# EAGLE design or-clock_main (EAGLE 6.5.0)
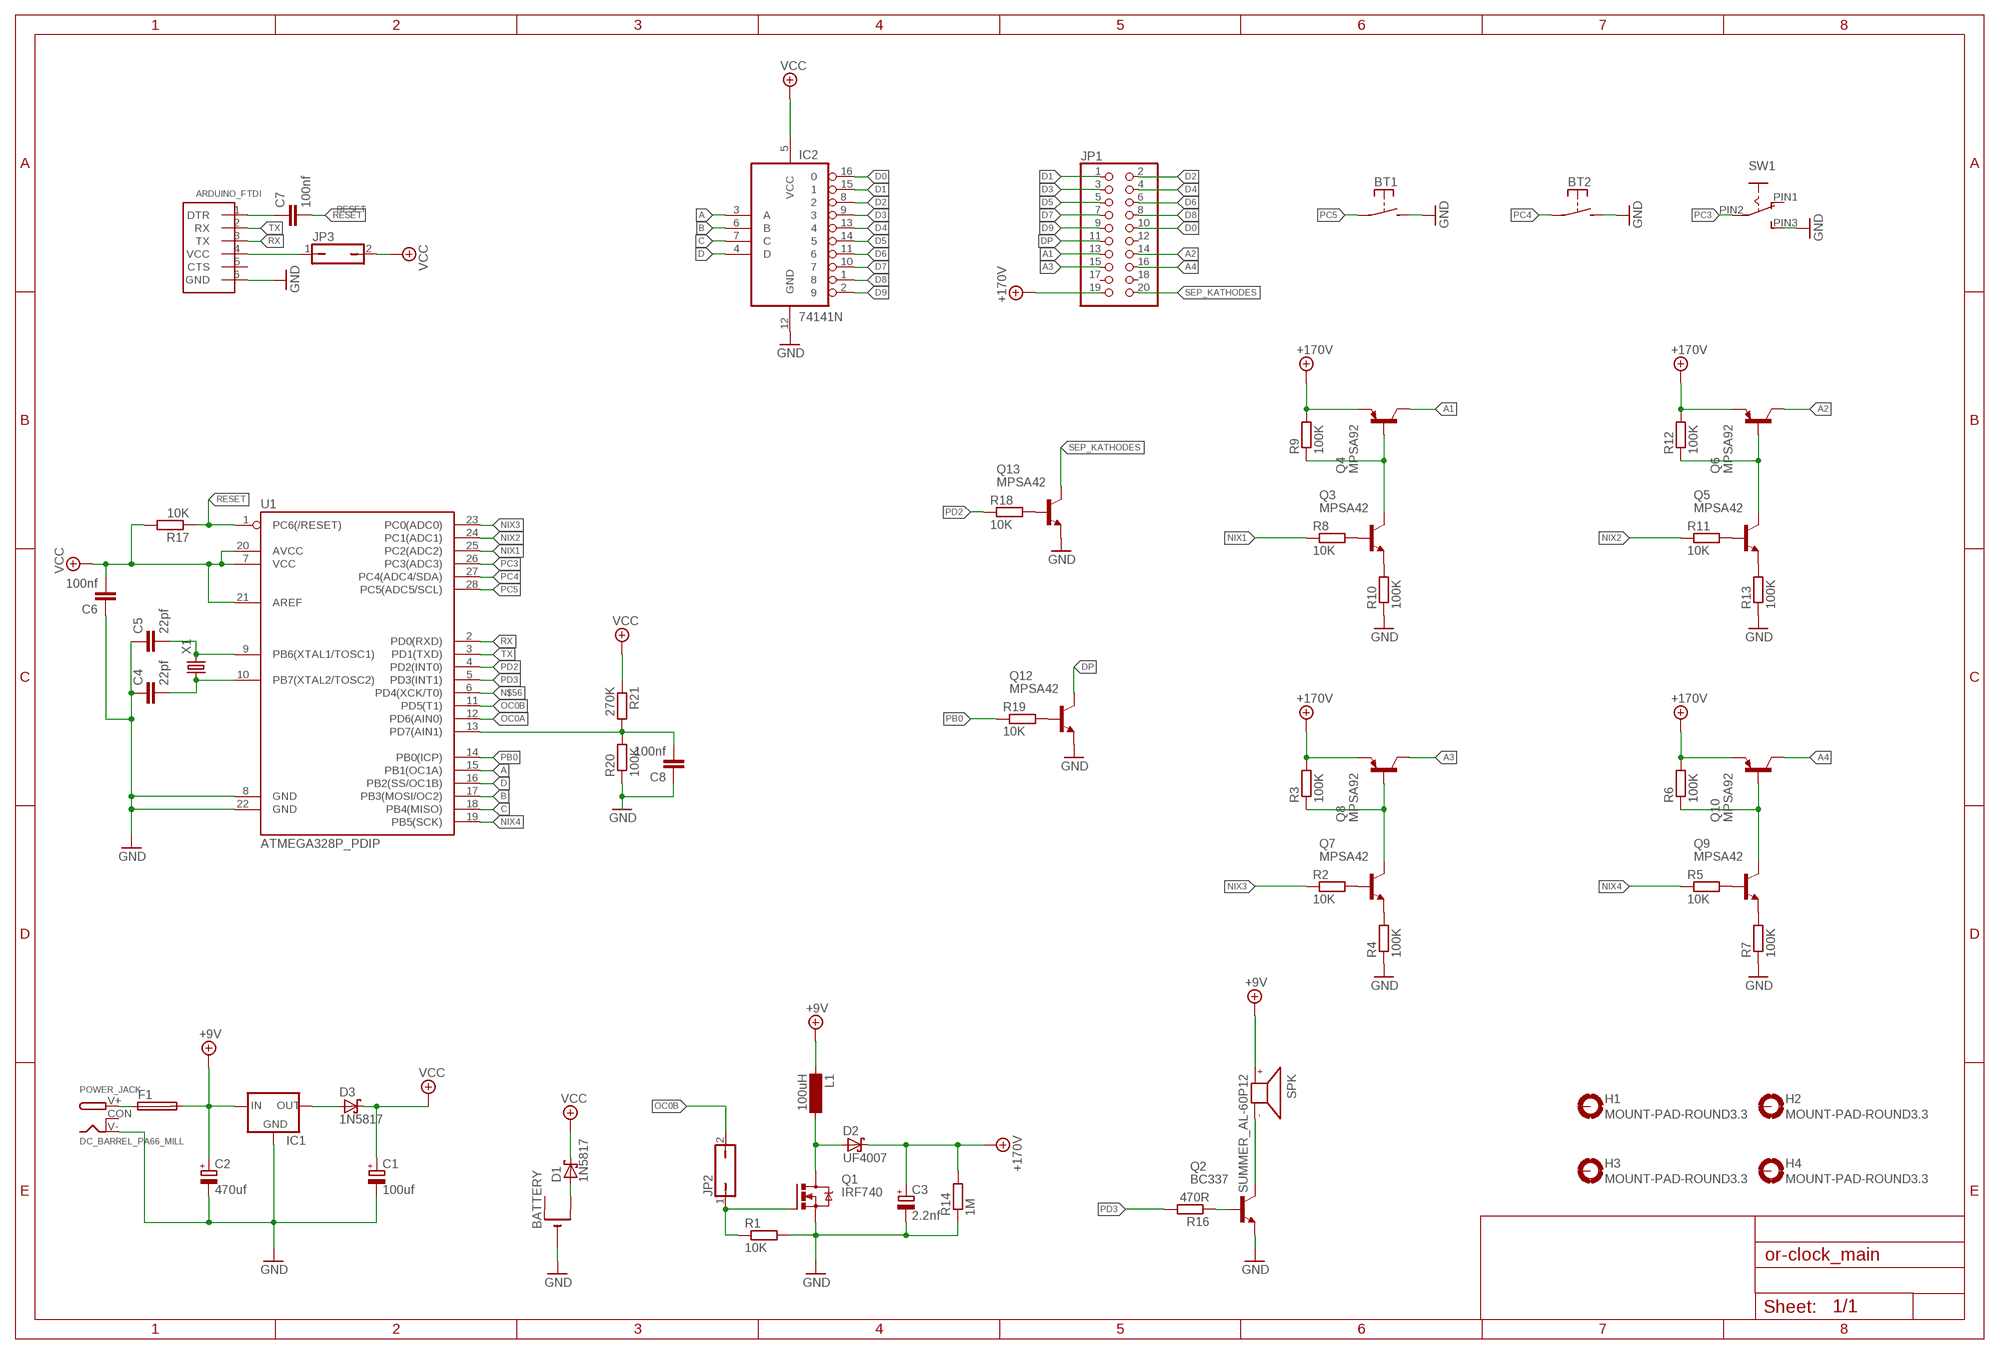
[diagram p0: schematic, sheet 1]

## Parts
BATTERY  CR1220THM  [CR1220-THM]
BT1  SWITCH_3305D  [BUT3305D]
BT2  SWITCH_3305D  [BUT3305D]
C1  100uf  CPOL-EUE5-6  [E5-6]
C2  470uf  CPOL-EUE5-10.5  [E5-10,5]
C3  2.2nf  CPOL-EUE5-8.5  [E5-8,5]
C4  22pf  C-EU025-025X050  [C025-025X050]
C5  22pf  C-EU025-025X050  [C025-025X050]
C6  100nf  C-EU025-025X050  [C025-025X050]
C7  100nf  C-EU025-025X050  [C025-025X050]
C8  100nf  C-EU025-025X050  [C025-025X050]
D1  1N5817  1N5817-B  [DO41-7.6]
D2  UF4007  1N5817-B  [DO41-7.6]
D3  1N5817  1N5817-B  [DO41-7.6]
F1  LITTLEFUSE  [LITTLEFUSE]
H1  MOUNT-PAD-ROUND3.3  [3,3-PAD]
H2  MOUNT-PAD-ROUND3.3  [3,3-PAD]
H3  MOUNT-PAD-ROUND3.3  [3,3-PAD]
H4  MOUNT-PAD-ROUND3.3  [3,3-PAD]
IC1  78XXS  [78XXS]
IC2  74141N  [DIL16]
JP1  PINHD-2X10_FEMALE  [2X10]
JP2  JP1Q  [JP1]
JP3  JP1Q  [JP1]
L1  100uH  BS11  [BS11]
POWER_JACK  DC_BARREL_PA66_MILL  [PA66_DC_JACK_MILL]
Q1  IRF740  [TO220BV]
Q2  BC337  BC547TO92_STRAIT  [TO92-]
Q3  MPSA42  [TO92-]
Q4  MPSA92  [TO92-]
Q5  MPSA42  [TO92-]
Q6  MPSA92  [TO92-]
Q7  MPSA42  [TO92-]
Q8  MPSA92  [TO92-]
Q9  MPSA42  [TO92-]
Q10  MPSA92  [TO92-]
Q12  MPSA42  [TO92-]
Q13  MPSA42  [TO92-]
R1  10K  R-EU_0207/2V  [0207/2V]
R2  10K  R-EU_0207/2V  [0207/2V]
R3  100K  R-EU_0207/2V  [0207/2V]
R4  100K  R-EU_0207/2V  [0207/2V]
R5  10K  R-EU_0207/2V  [0207/2V]
R6  100K  R-EU_0207/2V  [0207/2V]
R7  100K  R-EU_0207/2V  [0207/2V]
R8  10K  R-EU_0207/2V  [0207/2V]
R9  100K  R-EU_0207/2V  [0207/2V]
R10  100K  R-EU_0207/2V  [0207/2V]
R11  10K  R-EU_0207/2V  [0207/2V]
R12  100K  R-EU_0207/2V  [0207/2V]
R13  100K  R-EU_0207/2V  [0207/2V]
R14  1M  R-EU_0207/7  [0207/7]
R16  470R  R-EU_0207/2V  [0207/2V]
R17  10K  R-EU_0207/2V  [0207/2V]
R18  10K  R-EU_0207/2V  [0207/2V]
R19  10K  R-EU_0207/2V  [0207/2V]
R20  100K  R-EU_0207/2V  [0207/2V]
R21  270K  R-EU_0207/2V  [0207/2V]
SERIAL_CON  ARDUINO_FTDI_HEADERV  [1X06]
SPK  SUMMER_AL-60P12  [AL-60P12_SUMMER]
SW1  13P_SW  [TS-13P]
U1  ATMEGA328P_PDIP  [DIL28-3]
X1  CRYSTALTC26V  [TC26V]

## Nets
+5V: C1.+ C6.2 D1.C D3.C IC2.5(VCC) JP3.2 R17.2 R21.1 U1.7(VCC) U1.20(AVCC) U1.21(AREF) ; supply symbol labelled VCC
+9V: C2.+ F1.2 IC1.IN L1.1 SPK.POS(+)
+170V: C3.+ D2.C JP1.19 Q4.3(E) Q6.3(E) Q8.3(E) Q10.3(E) R3.2 R6.2 R9.2 R12.2 R14.2
A: IC2.3(A) U1.15(PB1(OC1A))
A1: JP1.13 Q4.1(C)
A2: JP1.14 Q6.1(C)
A3: JP1.15 Q8.1(C)
A4: JP1.16 Q10.1(C)
B: IC2.6(B) U1.17(PB3(MOSI/OC2))
C: IC2.7(C) U1.18(PB4(MISO))
D: IC2.4(D) U1.16(PB2(SS/OC1B))
D0: IC2.16 JP1.10
D1: IC2.15 JP1.1
D2: IC2.8 JP1.2
D3: IC2.9 JP1.3
D4: IC2.13 JP1.4
D5: IC2.14 JP1.5
D6: IC2.11 JP1.6
D7: IC2.10 JP1.7
D8: IC2.1 JP1.8
D9: IC2.2 JP1.9
DP: JP1.11 Q12.1(C)
GND: BATTERY.- BT1.P$2(S) BT2.P$2(S) C1.- C2.- C3.- C4.1 C5.1 C6.1 C8.1 IC1.GND IC2.12(GND) POWER_JACK.V-(GND) Q1.S Q2.1(E) Q12.3(E) Q13.3(E) R1.2 R4.1 R7.1 R10.1 R13.1 R14.1 R20.1 SERIAL_CON.6(GND) SW1.PIN3(S) U1.8(GND) U1.22(GND)
N$1: BATTERY.+2(+1) D1.A
N$2: D2.A L1.2 Q1.D
N$3: D3.A IC1.OUT
N$5: Q7.2(B) R2.2
N$6: Q7.3(E) R4.2
N$7: Q7.1(C) Q8.2(B) R3.1
N$9: Q9.2(B) R5.2
N$11: Q9.1(C) Q10.2(B) R6.1
N$13: Q9.3(E) R7.2
N$14: Q3.2(B) R8.2
N$16: Q3.1(C) Q4.2(B) R9.1
N$18: Q3.3(E) R10.2
N$19: Q5.2(B) R11.2
N$21: Q5.1(C) Q6.2(B) R12.1
N$23: Q5.3(E) R13.2
N$24: F1.1 POWER_JACK.V+(PWR)
N$26: Q2.2(B) R16.1
N$28: Q2.3(C) SPK.NEG(-)
N$29: JP3.1 SERIAL_CON.4(VCC)
N$30: C7.1 SERIAL_CON.1(DTR)
N$31: C5.2 U1.9(PB6(XTAL1/TOSC1)) X1.2
N$32: C4.2 U1.10(PB7(XTAL2/TOSC2)) X1.1
N$33: Q13.2(B) R18.2
N$34: Q12.2(B) R19.2
N$46: C8.2 R20.2 R21.2 U1.13(PD7(AIN1))
N$56: U1.6(PD4(XCK/T0))
NIX1: R8.1 U1.25(PC2(ADC2))
NIX2: R11.1 U1.24(PC1(ADC1))
NIX3: R2.1 U1.23(PC0(ADC0))
NIX4: R5.1 U1.19(PB5(SCK))
OC0A: U1.12(PD6(AIN0))
OC0B: JP2.2 U1.11(PD5(T1))
PB0: R19.1 U1.14(PB0(ICP))
PC3: SW1.PIN2(P) U1.26(PC3(ADC3))
PC4: BT2.P$1(P) U1.27(PC4(ADC4/SDA))
PC5: BT1.P$1(P) U1.28(PC5(ADC5/SCL))
PD2: R18.1 U1.4(PD2(INT0))
PD3: R16.2 U1.5(PD3(INT1))
PWM: JP2.1 Q1.G R1.1
RESET: C7.2 R17.1 U1.1(PC6(/RESET))
RX: SERIAL_CON.3(TX) U1.2(PD0(RXD))
SEP_KATHODES: JP1.20 Q13.1(C)
TX: SERIAL_CON.2(RX) U1.3(PD1(TXD))
Unconnected: BATTERY.+1(+) H1.B3,3(MOUNT) H2.B3,3(MOUNT) H3.B3,3(MOUNT) H4.B3,3(MOUNT) JP1.12 JP1.17 JP1.18 SERIAL_CON.5(CTS) SW1.PIN1(O)

## Power pins joined to a net without a drawn wire
GNDBREAK: POWER_JACK.CON(GNDBREAK)

## Library data of the parts
BATTERY = nixkit_parts:CR1220: CR1216/CR1220/CR1225 12mm 3V lithium coin cell Great for battery packup. Both SMT and THM holders. Note the THM package has the ground pads on both sides of the PCB so that the masks are the same - this reduces the cost
BT1 BT2 = nixkit_parts:SWITCH_3305D
C1-C3 = caps:CPOL-EU: POLARIZED CAPACITOR, European symbol
C4-C8 = caps:C-EU: CAPACITOR, European symbol
D1-D3 = diodes:1N581*: 1.0A SCHOTTKY BARRIER RECTIFIER Source: http://www.diodes.com/datasheets/ds23001.pdf
F1 = nixkit_parts:LITTLEFUSE: LITTLEFUSE Picofuse/slow Littlefuse
H1-H4 = nixkit_parts:MOUNT-PAD-ROUND: MOUNTING PAD, round
IC1 = regulators:78XXS: VOLTAGE REGULATOR
IC2 = nixkit_parts:74*141: BCD to decimal DECODER/DRIVER
JP1 = nixkit_parts:PINHD-2X10_FEMALE: PIN HEADER
JP2 JP3 = nixkit_parts:JP1Q: JUMPER
L1 = nixkit_parts:BS: INDUCTOR nominal inductance, magnetically screened; OC_FARNELL: unknown; OC_NEWARK: unknown
POWER_JACK = nixkit_parts:DC_BARREL_PA66_MILL
Q1 = nixkit_parts:IRF740: N-CHANNEL MOS FET
Q2 = nixkit_parts:BC547*: NPN Transistor
Q3 Q5 Q7 Q9 Q12 Q13 = nixkit_parts:MPSA42: NPN Hight voltage transistor
Q4 Q6 Q8 Q10 = nixkit_parts:MPSA92: PNP Hight voltage transistor
R1-R14 R16-R21 = resistors:R-EU_: RESISTOR, European symbol
SERIAL_CON = arduino_serial_connector:ARDUINO_FTDI_HEADER
SPK = nixkit_parts:SUMMER_AL-60P12
SW1 = nixkit_parts:13P_SW
U1 = nixkit_parts:ATMEGA328P_PDIP: uC used in the Arduino 32kb flash, 1k EEPROM, 2k SRAM This is the through-hole version of this chip.
X1 = crystals:CRYSTAL: CRYSTAL; OC_FARNELL: unknown; OC_NEWARK: unknown

## Board
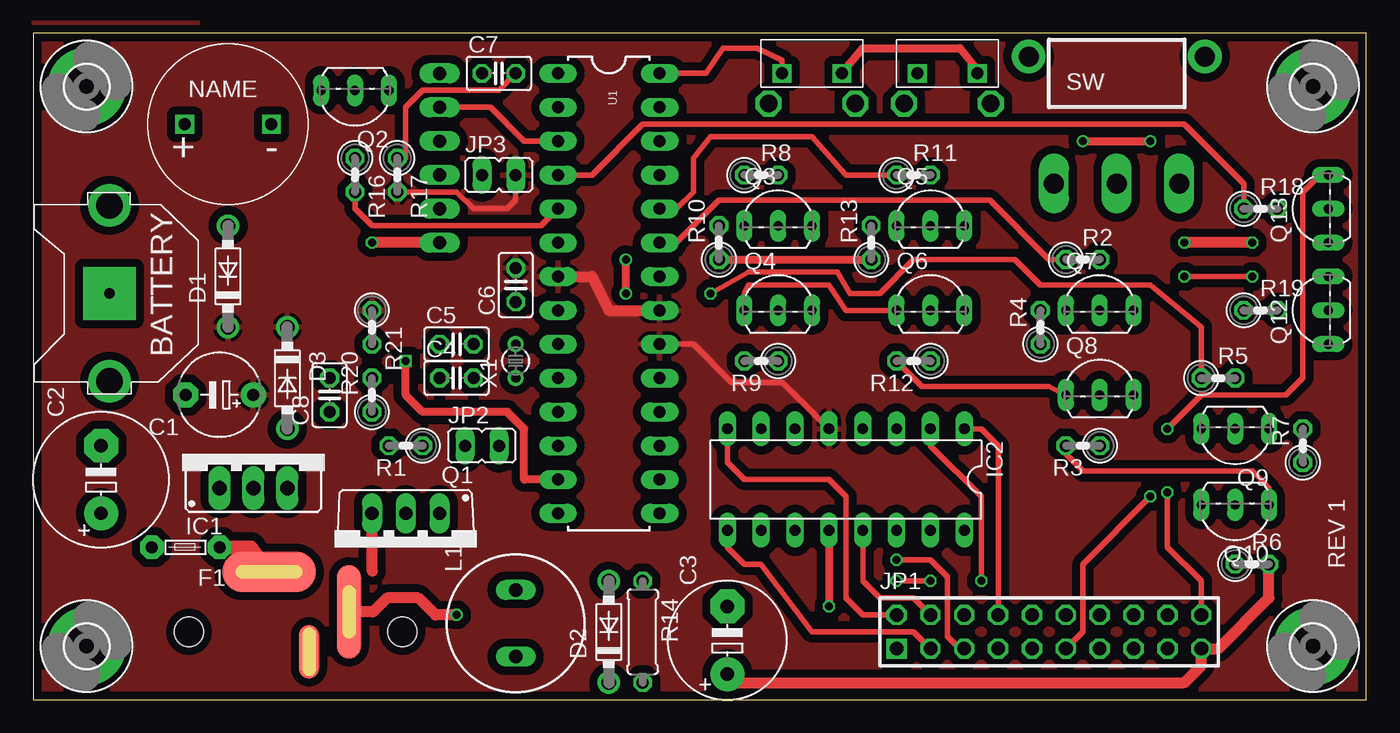
[diagram p1: board, top side]
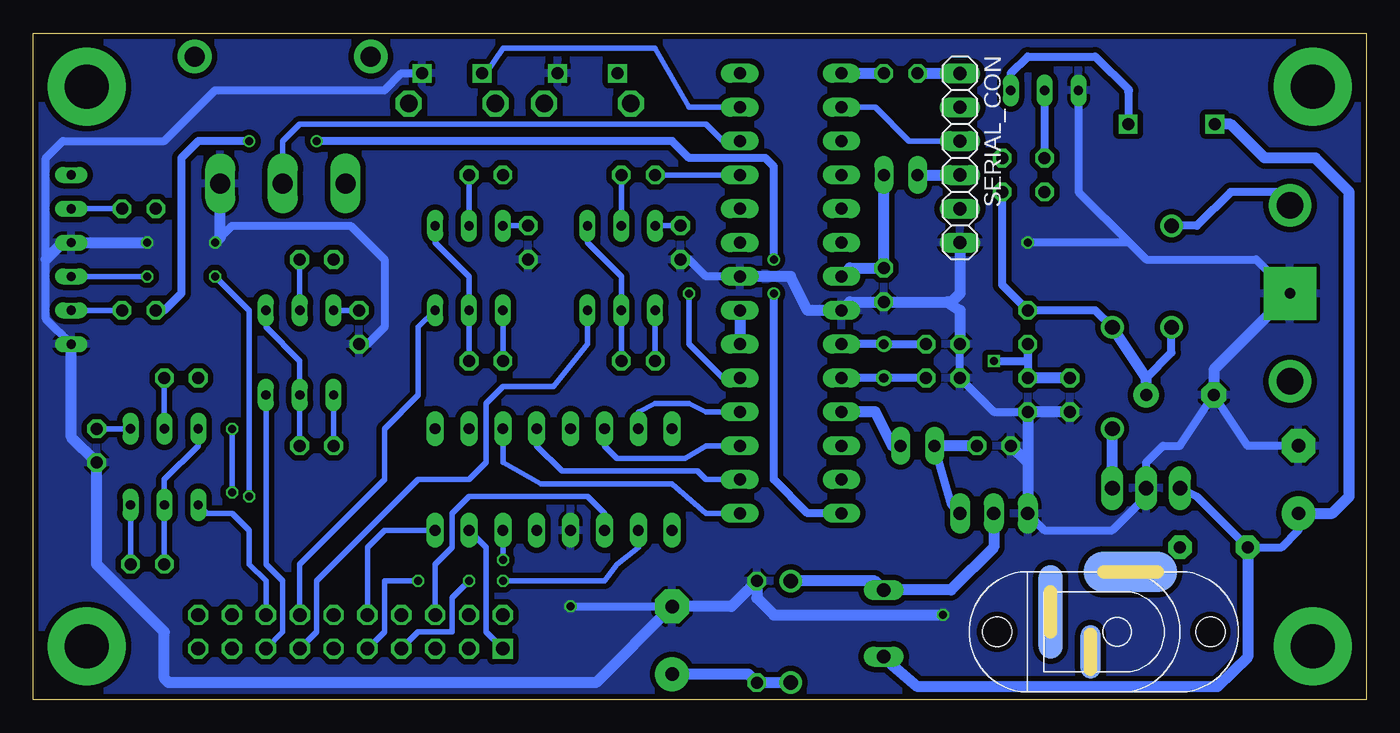
[diagram p2: board, bottom side, seen from below]

Size 100 x 50 mm. Coordinates in mm from the lower left corner, seen from the top.
Outline: 0,0 100,0 100,50 0,50 0,0
Copper layers (1*16): Top 0.035mm / dielectric 1.5mm / Bottom 0.035mm
Design rules "SeeedStudio_2layer_DRU_no_angle_20140221": minimum track width 6mil, minimum drill 12mil, track to track 6mil, track to pad 6mil, pad to pad 6mil, via to via 6mil, smd to smd 0mil, copper to edge 10mil, drill to drill 10mil, minimum pad ring 10mil, minimum via ring 6mil, stop-mask expansion 2mil, vias tented up to drill 100mil, thermal gap 10mil

### Footprints (pad centres in the part's own frame; a part is rotated, then mirrored left to right if it is on the bottom)
CR1220-THM = drill 2 pad 3.175: +1 -6.604,0; +2 6.604,0 | drill 0.8 pad 3.962 square: - 0,0
BUT3305D = drill 0.9 square: P$1 -2.248,-2.54; P$2 2.248,-2.54 | drill 1.3 octagon: P$3 -3.251,-4.801; P$4 3.251,-4.801
E5-6 = drill 0.9 pad 1.905: + -2.54,0 | drill 0.9 pad 1.905 octagon: - 2.54,0
E5-10,5 = drill 1 pad 2.54: + -2.54,0 | drill 1 pad 2.54 octagon: - 2.54,0
E5-8,5 = drill 1 pad 2.54: + -2.54,0 | drill 1 pad 2.54 octagon: - 2.54,0
C025-025X050 = drill 0.9 octagon: 1 -1.27,0; 2 1.27,0
DO41-7.6 = drill 1.1 pad 1.7: A 3.81,0; C -3.81,0
LITTLEFUSE = drill 0.9 pad 1.778 octagon: 1 -5.08,0; 2 0,0
3,3-PAD = drill 3.3 pad 5.842: B3,3 0,0
78XXS = drill 1.1 long: GND 0,-2.54; IN -2.54,-2.54; OUT 2.54,-2.54
DIL16 = drill 0.813 long: 1 -8.89,-3.81; 2 -6.35,-3.81; 3 -3.81,-3.81; 4 -1.27,-3.81; 5 1.27,-3.81; 6 3.81,-3.81; 7 6.35,-3.81; 8 8.89,-3.81; 9 8.89,3.81; 10 6.35,3.81; 11 3.81,3.81; 12 1.27,3.81; 13 -1.27,3.81; 14 -3.81,3.81; 15 -6.35,3.81; 16 -8.89,3.81
2X10 = drill 1.016 square: 1 -11.43,-1.27 | drill 1.016 octagon: 2 -11.43,1.27; 3 -8.89,-1.27; 4 -8.89,1.27; 5 -6.35,-1.27; 6 -6.35,1.27; 7 -3.81,-1.27; 8 -3.81,1.27; 9 -1.27,-1.27; 10 -1.27,1.27; 11 1.27,-1.27; 12 1.27,1.27; 13 3.81,-1.27; 14 3.81,1.27; 15 6.35,-1.27; 16 6.35,1.27; 17 8.89,-1.27; 18 8.89,1.27; 19 11.43,-1.27; 20 11.43,1.27
JP1 = drill 0.9 long: 1 0,-1.27; 2 0,1.27
BS11 = drill 1 long: 1 -2.5,0; 2 2.5,0
PA66_DC_JACK_MILL = smd 4 x 1.5 bottom: CON 1.5,-1 | smd 4 x 1.5: CON1 1.5,-1 | smd 3 x 7 bottom: V+ -4.5,2 | smd 3 x 7: V+1 -4.5,2 | smd 7 x 1.8 bottom: V- -1.5,-4 | smd 7 x 1.8: V-1 -1.5,-4 | hole 2.2: 0,8; 0,-8
TO220BV = drill 1 long: D 0,-2.54; G -2.54,-2.54; S 2.54,-2.54
TO92- = drill 0.7 long: 1 2.54,-1.27; 2 0,-1.27; 3 -2.54,-1.27
0207/2V = drill 0.9 octagon: 1 -1.27,0; 2 1.27,0
0207/7 = drill 0.9 octagon: 1 -3.81,0; 2 3.81,0
1X06 = drill 1 long: 1 -6.35,0; 2 -3.81,0; 3 -1.27,0; 4 1.27,0; 5 3.81,0; 6 6.35,0
AL-60P12_SUMMER = drill 0.9 square: NEG 3.25,0; POS -3.25,0
TS-13P = drill 1.5 pad 2.54: P$4 -6.604,0; P$5 6.604,0 | drill 1.5 long: PIN1 -4.699,-9.525; PIN2 0,-9.525; PIN3 4.699,-9.525
DIL28-3 = drill 0.9 long: 1 -16.51,-3.81; 2 -13.97,-3.81; 3 -11.43,-3.81; 4 -8.89,-3.81; 5 -6.35,-3.81; 6 -3.81,-3.81; 7 -1.27,-3.81; 8 1.27,-3.81; 9 3.81,-3.81; 10 6.35,-3.81; 11 8.89,-3.81; 12 11.43,-3.81; 13 13.97,-3.81; 14 16.51,-3.81; 15 16.51,3.81; 16 13.97,3.81; 17 11.43,3.81; 18 8.89,3.81; 19 6.35,3.81; 20 3.81,3.81; 21 1.27,3.81; 22 -1.27,3.81; 23 -3.81,3.81; 24 -6.35,3.81; 25 -8.89,3.81; 26 -11.43,3.81; 27 -13.97,3.81; 28 -16.51,3.81
TC26V = drill 0.7: 1 -1.27,0; 2 1.27,0

### Placement (x,y rotation side)
BATTERY  5.71,30.48 90 top
BT1  58.42,49.53 0 top
BT2  68.58,49.53 0 top
C1  13.97,22.86 180 top
C2  5.08,16.51 90 top
C3  52.07,4.45 90 top
C4  31.75,24.13 0 top
C5  31.75,26.67 0 top
C6  36.2,31.11 90 top
C7  34.92,46.99 0 top
C8  22.23,22.86 90 top
D1  14.61,31.75 90 top
D2  43.18,5.08 90 top
D3  19.05,24.13 270 top
F1  8.89,11.43 180 top
H1  4,46 0 top
H2  96,46 0 top
H3  96,4 0 top
H4  4,4 0 top
IC1  16.51,18.41 0 top
IC2  60.96,16.51 180 top
JP1  76.2,5.08 0 top
JP2  33.66,19.05 270 top
JP3  34.92,39.37 270 top
L1  36.2,5.71 90 top
POWER_JACK  19.68,5.08 270 bottom
Q1  27.94,11.43 180 top
Q2  24.13,44.45 180 top
Q3  55.88,36.83 0 top
Q4  55.88,30.48 0 top
Q5  67.31,36.83 0 top
Q6  67.31,30.48 0 top
Q7  80.01,30.48 0 top
Q8  80.01,24.13 0 top
Q9  90.17,19.05 180 top
Q10  90.17,13.34 180 top
Q12  95.89,29.21 90 top
Q13  95.89,36.83 90 top
R1  27.94,19.05 180 top
R2  78.74,33.02 0 top
R3  78.74,19.05 180 top
R4  75.56,27.94 90 top
R5  88.9,24.13 0 top
R6  91.44,10.16 0 top
R7  95.25,19.05 90 top
R8  54.61,39.37 0 top
R9  54.61,25.4 180 top
R10  51.44,34.29 90 top
R11  66.04,39.37 0 top
R12  66.04,25.4 180 top
R13  62.87,34.29 90 top
R14  45.72,5.08 270 top
R16  24.13,39.37 270 top
R17  27.3,39.37 270 top
R18  92.08,36.83 0 top
R19  92.08,29.21 0 top
R20  25.4,22.86 90 top
R21  25.4,27.94 270 top
SERIAL_CON  30.48,40.64 270 bottom
SPK  14.61,43.18 0 top
SW1  81.28,48.26 0 top
U1  43.18,30.48 270 top
X1  36.2,25.4 90 top

### Tracks (layer width: path | path; a pad name or v marks a point on that pad's centre or on a via)
+5V
  Top 0.406: R17.2 31.75,38.1 33.02,36.83 35.56,36.83 36.2,37.47 JP3.2 | IC2.5 56.2,23.81 52.39,23.81 49.53,26.67 U1.20
  Top 0.813: U1.7 41.91,31.75 43.18,29.21 U1.21
  Bottom 0.61: 16.51,24.13 14.61,26.04 D1.C | D3.C 20.32,29.21 R21.1 27.3,31.11 R17.2
  Bottom 0.813: C1.+ 16.51,24.13 D3.C | U1.7 38.73,32.38 C6.2 JP3.2 | U1.21 U1.20
  pour Top (isolate 0.61): 0,50.8 100.01,50.48 100.01,-0.32 0,0
+9V
  Bottom 0.61: C2.+ 5.08,12.7 6.35,11.43 F1.2 12.7,15.24 IC1.IN
  Bottom 0.813: F1.2 8.89,3.17 11.15,0.96 33.66,0.96 35.52,2.54 L1.1 | C2.+ 2.54,13.97 1.27,15.24 1.27,38.1 3.81,40.64 7.62,40.64 10.16,43.18 SPK.POS
+170V
  Top 0.406: Q10.3 92.71,15.88 91.44,17.14 78.74,17.14 77.47,18.41 R3.2 | Q8.3 76.2,23.5 66.67,23.5 R12.2 | Q6.3 60.96,29.21 59.69,31.11 53.66,31.11 53.34,30.48 Q4.3
  Top 0.813: C3.+ 52.7,1.27 86.36,1.27 87.63,2.54 JP1.19 88.9,3.81 92.71,7.62 R6.2
  Bottom 0.406: Q4.3 R9.2 | R12.2 Q6.3 | Q8.3 R3.2 | R6.2 Q10.3
  Bottom 0.813: D2.C R14.2 46.35,1.91 C3.+
A
  Bottom 0.406: U1.15 49.53,13.97 52.07,16.19 61.91,16.19 64.77,17.78 IC2.3
A1
  Bottom 0.406: Q4.1 58.42,26.67 60.96,23.5 64.77,23.5 66.04,22.23 66.04,17.78 67.31,16.51 71.12,16.51 78.74,8.89 78.74,5.08 JP1.13
A2
  Bottom 0.406: Q6.1 71.12,27.94 71.12,22.86 73.66,20.32 73.66,16.51 80.01,10.16 JP1.14
A3
  Bottom 0.406: Q8.1 82.55,10.16 81.28,8.89 81.28,5.08 JP1.15
A4
  Bottom 0.406: Q10.1 87,13.97 85.09,13.97 83.82,12.7 83.82,10.16 82.55,8.89 JP1.16
B
  Bottom 0.406: U1.17 49.53,19.05 51.12,18.1 56.2,18.1 57.15,19.05 IC2.6
C
  Bottom 0.406: U1.18 49.53,21.59 50.8,22.23 53.34,22.23 54.61,21.59 IC2.7
D
  Bottom 0.406: U1.16 49.53,16.51 50.16,17.14 60.33,17.14 62.23,19.05 IC2.4
D0
  Bottom 0.406: IC2.16 73.66,12.7 74.93,11.43 JP1.10
D1
  Bottom 0.406: IC2.15 66.04,11.43 66.04,5.08 JP1.1
D2
  Top 0.406: IC2.8 52.07,17.78 53.34,16.51 59.69,16.51 60.96,15.24 60.96,7.62 62.23,6.35 JP1.2
D3
  Top 0.406: IC2.9 52.07,11.43 53.34,10.16 54.61,10.16 58.42,5.08 66.04,5.08 JP1.3
D4
  Top 0.406: IC2.13 62.23,8.89 63.5,7.62 66.04,7.62 JP1.4
D5  (via drill 0.6)
  Top 0.406: v64.77,10.48 67.31,10.48 68.58,9.21 68.58,4.76 69.53,3.81 JP1.5
  Bottom 0.406: IC2.14 v64.77,10.48
D6
  Bottom 0.406: IC2.11 57.15,13.97 58.42,15.24 67.31,15.24 68.58,13.97 68.58,11.43 69.85,10.16 JP1.6
D7  (via drill 0.6)
  Top 0.406: v64.77,8.89 v67.31,8.89
  Bottom 0.406: IC2.10 54.61,11.43 56.2,10.16 57.15,8.89 v64.77,8.89 | v67.31,8.89 68.58,7.62 68.58,5.08 71.12,5.08 JP1.7
D8
  Top 0.406: JP1.8 72.39,19.05 71.12,20.32 IC2.1
D9  (via drill 0.6)
  Top 0.406: IC2.2 67.31,19.05 71.12,15.24 v71.12,8.89
  Bottom 0.406: v71.12,8.89 73.66,8.89 73.66,5.08 JP1.9
DP  (via drill 0.6)
  Top 0.406: v91.44,31.75 v86.36,31.75 | v83.82,15.24 78.74,10.16 78.74,5.08 JP1.11
  Bottom 0.406: Q12.1 v91.44,31.75 | v86.36,31.75 83.82,29.21 v83.82,15.24
GND  (via drill 0.6)
  Top 0.406: 70.83,47.28 BT2.P$2
  Top 0.61: IC2.12 v59.69,6.99 | BT1.P$2 62.26,48.9 69.53,48.9 70.83,47.28 | R10.1 R13.1
  Top 0.813: 25.43,9.62 25.4,11.36 Q1.S | v31.75,6.35 30.16,6.35 28.89,7.62 26.53,7.62 25.49,6.58 POWER_JACK.V- | v91.44,34.29 v86.36,34.29 | SERIAL_CON.6 v25.4,34.29
  Bottom 0.61: C2.- 8.89,19.05 C1.- 13.97,19.05 15.24,19.05 16.51,17.78 IC1.GND 16.51,15.24 19.05,12.7 24.13,12.7 Q1.S | C5.1 C4.1 27.94,21.59 R20.1 | v59.69,6.99 C3.- | Q12.3 99.06,28.57 99.06,33.02 99.06,40.64 97.79,41.91 90.17,41.91 86.36,45.72 73.66,45.72 72.39,46.99 BT2.P$2 | U1.22 49.53,31.75 50.8,33.02 R10.1 | 85.98,34.67 85.09,35.56 76.2,35.56 73.66,33.02 73.66,27.94 74.93,26.67 R4.1 | Q2.1 21.59,38.1 17.78,34.29 | BATTERY.- 8.26,33.02 16.51,33.02 17.78,34.29 | 17.78,34.29 v25.4,34.29
  Bottom 0.813: BATTERY.- 11.43,24.77 C1.- | 25.4,17.78 R20.1 C8.1 | 25.4,17.78 Q1.S | 31.43,29.84 C6.1 38.73,29.84 U1.8 41.91,29.21 43.18,31.75 U1.22 | 31.43,29.84 30.48,29.21 C5.1 | v31.75,6.35 44.45,6.35 45.72,7.62 R14.1 47.62,6.99 C3.- 57.78,1.27 89.85,1.27 90.17,1.59 90.17,5.08 95.25,10.16 R7.1 97.16,19.68 Q12.3 | SERIAL_CON.6 30.48,30.48 31.11,29.84 31.43,29.84 | R1.2 25.4,17.78 | 99.06,33.02 97.79,34.29 Q13.3 v91.44,34.29 | v86.36,34.29 85.98,34.67 SW1.PIN3
  pour Bottom (isolate 0.406): 0,50.8 100.01,50.48 100.01,-1.27 0,-1.27
N$1
  Bottom 0.61: BATTERY.+2 6.73,38.1 10.16,38.1 12.7,35.56 D1.A
N$2
  Bottom 0.813: Q1.D 27.94,11.43 31.16,8.21 L1.2 36.87,8.89 D2.A
N$3
  Bottom 0.813: IC1.OUT D3.A
N$5
  Bottom 0.406: R2.2 Q7.2
N$6
  Bottom 0.406: R4.2 Q7.3
N$7
  Bottom 0.406: Q7.1 82.55,27.94 80.01,25.4 Q8.2 R3.1
N$9
  Bottom 0.406: R5.2 Q9.2
N$11
  Bottom 0.406: R6.1 Q10.2 90.17,16.51 87.63,19.05 Q9.1
N$13
  Bottom 0.406: R7.2 Q9.3
N$14
  Bottom 0.406: R8.2 Q3.2
N$16
  Bottom 0.406: Q3.1 58.42,34.29 55.88,31.75 Q4.2 R9.1
N$18
  Bottom 0.406: R10.2 Q3.3
N$19
  Bottom 0.406: R11.2 Q5.2
N$21
  Bottom 0.406: Q5.1 69.85,34.29 67.31,31.75 Q6.2 R12.1
N$23
  Bottom 0.406: R13.2 Q5.3
N$24
  Top 1.016: POWER_JACK.V+ 16.34,11.43 F1.1
N$26
  Bottom 0.61: Q2.2 R16.1
N$28
  Bottom 0.61: SPK.NEG 17.86,45.65 17.78,45.72 20.32,48.26 25.4,48.26 26.67,46.99 Q2.3
N$29
  Bottom 0.813: JP3.1 SERIAL_CON.4
N$30
  Bottom 0.813: C7.1 SERIAL_CON.1
N$31
  Bottom 0.61: U1.9 X1.2 C5.2
N$32
  Bottom 0.61: C4.2 X1.1 U1.10
N$33
  Bottom 0.406: Q13.2 R18.2
N$34
  Bottom 0.406: Q12.2 R19.2
N$46  (via drill 0.6)
  Top 0.61: U1.13 36.83,16.51 36.83,20.32 35.56,21.59 29.21,21.59 27.94,22.86 v27.94,25.4
  Bottom 0.61: v27.94,25.4 25.4,25.4 R21.2 R20.2
  Bottom 0.813: C8.2 R20.2
NIX1
  Bottom 0.406: U1.25 R8.1
NIX2
  Top 0.406: U1.24 48.26,36.83 49.53,38.1 49.53,40.64 50.8,42.23 58.42,42.23 60.96,39.37 R11.1
NIX3
  Top 0.406: U1.23 48.26,34.29 51.44,37.47 71.75,37.47 76.2,33.02 R2.1
NIX4  (via drill 0.6)
  Top 0.406: v50.8,30.48 53.66,32.07 60.33,32.07 61.28,30.48 63.5,30.48 66.04,33.02 73.66,33.02 75.56,31.11 83.82,31.11 87.63,27.94 R5.1
  Bottom 0.406: U1.19 48.26,24.13 50.8,26.67 v50.8,30.48
OC0B
  Bottom 0.813: JP2.2 35.56,19.05 36.83,21.59 U1.11
PB0  (via drill 0.6)
  Top 0.61: v44.45,30.48 v44.45,33.02 | v78.74,41.91 v83.82,41.91
  Bottom 0.61: U1.14 41.91,13.97 44.45,16.51 v44.45,30.48 | v44.45,33.02 44.45,40.01 45.09,40.64 50.8,40.64 52.07,41.91 v78.74,41.91 | v83.82,41.91 87.63,41.91 88.9,40.64 88.9,30.48 90.17,29.21 R19.1
PC3
  Bottom 0.406: U1.26 48.26,41.91 49.53,43.18 80.01,43.18 81.28,41.91 SW1.PIN2
PC4
  Bottom 0.406: U1.27 50.8,44.45 53.34,48.9 64.77,48.9 66.04,46.99 BT2.P$1
PC5
  Top 0.406: U1.28 50.48,46.99 51.75,48.9 54.29,48.9 56.17,47.97 BT1.P$1
PD2
  Top 0.406: U1.4 41.91,39.37 45.72,43.18 86.36,43.18 90.81,38.73 R18.1
PD3
  Top 0.406: U1.5 38.1,35.56 25.4,35.56 24.13,36.83 R16.2
PWM
  Bottom 0.61: Q1.G 31.11,14.61 JP2.1
  Bottom 0.813: R1.1 JP2.1
RESET
  Top 0.406: C7.2 34.92,45.72 29.21,45.72 27.94,44.45 27.94,40.64 R17.1
  Bottom 0.813: U1.1 C7.2
RX
  Bottom 0.406: U1.2 36.83,44.45 34.29,41.91 SERIAL_CON.3
SEP_KATHODES  (via drill 0.6)
  Top 0.406: Q13.1 96.52,39.37 95.25,38.1 95.25,24.13 93.98,22.86 87.63,22.86 v85.09,20.32 | v85.09,15.56 85.09,11.43 87.63,8.89 JP1.20
  Bottom 0.406: v85.09,20.32 v85.09,15.56
TX
  Top 0.406: SERIAL_CON.2 34.29,44.45 36.83,41.91 U1.3

### Text on the board
tNames: REV 1